# EAGLE schematic Robot2 (EAGLE 9.6.2)
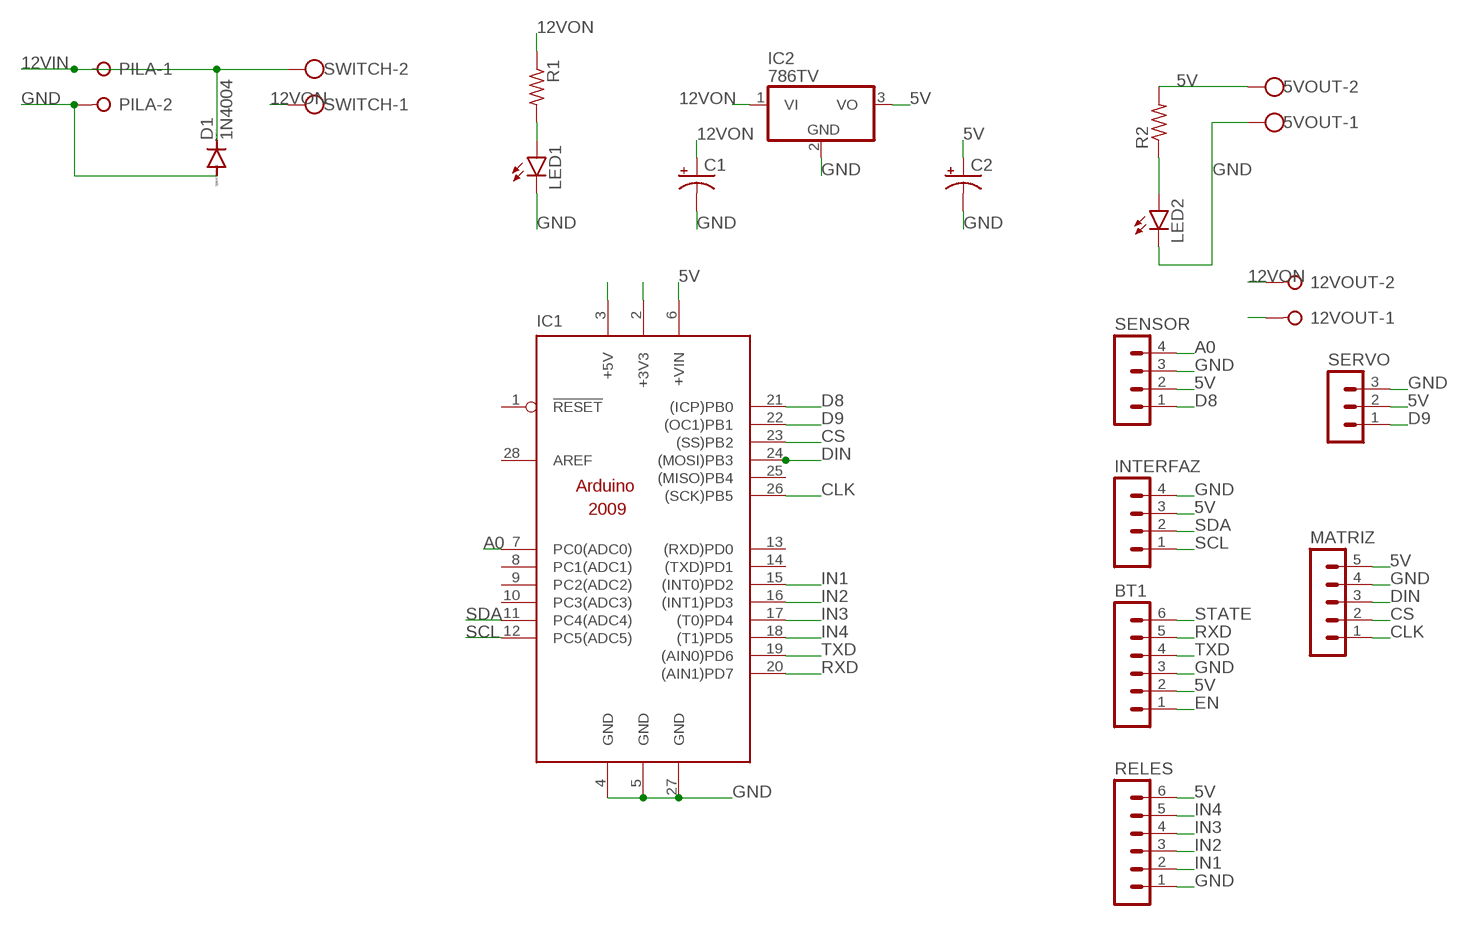
[diagram p0: schematic, sheet 1]

## Parts
5VOUT  W237-102  [W237-102]
12VOUT  W237-02P  [W237-132]
BT1  MA06-1  [MA06-1]
C1  CPOL-USE2,5-6E  [E2,5-6E]
C2  CPOL-USE2,5-6E  [E2,5-6E]
D1  1N4004  [DO41-10]
IC1  ARDUINO2009_PIN_11  [ARDUINO2009_1]
IC2  786TV  [TO220V]
INTERFAZ  MA04-1  [MA04-1]
LED1  LED3MM  [LED3MM]
LED2  LED3MM  [LED3MM]
MATRIZ  MA05-1  [MA05-1]
PILA  W237-02P  [W237-132]
R1  R-US_0204/7  [0204/7]
R2  R-US_0204/7  [0204/7]
RELES  MA06-1  [MA06-1]
SENSOR  MA04-1  [MA04-1]
SERVO  MA03-1  [MA03-1]
SWITCH  W237-102  [W237-102]

## Nets
5V: 5VOUT.2 BT1.2 C2.+ IC1.6(+VIN) IC2.3(VO) INTERFAZ.3 MATRIZ.5 R2.2 RELES.6 SENSOR.2 SERVO.2
12VIN: D1.C PILA.1 SWITCH.2
12VON: 12VOUT.2 C1.+ IC2.1(VI) R1.1 SWITCH.1
A0: IC1.7(PC0(ADC0)) SENSOR.4
CLK: IC1.26((SCK)PB5) MATRIZ.1
CS: IC1.23((SS)PB2) MATRIZ.2
D8: IC1.21((ICP)PB0) SENSOR.1
D9: IC1.22((OC1)PB1) SERVO.1
DIN: IC1.24((MOSI)PB3) MATRIZ.3
EN: BT1.1
GND: 5VOUT.1 12VOUT.1 BT1.3 C1.- C2.- D1.A IC1.4(GND) IC1.5(GND) IC1.27(GND) IC2.2(GND) INTERFAZ.4 LED1.K(C) LED2.K(C) MATRIZ.4 PILA.2 RELES.1 SENSOR.3 SERVO.3
IN1: IC1.15((INT0)PD2) RELES.2
IN2: IC1.16((INT1)PD3) RELES.3
IN3: IC1.17((T0)PD4) RELES.4
IN4: IC1.18((T1)PD5) RELES.5
N$1: LED1.A R1.2
N$10: LED2.A R2.1
N$12: IC1.3(+5V)
N$13: IC1.2(+3V3)
RXD: BT1.5 IC1.20((AIN1)PD7)
SCL: IC1.12(PC5(ADC5)) INTERFAZ.1
SDA: IC1.11(PC4(ADC4)) INTERFAZ.2
STATE: BT1.6
TXD: BT1.4 IC1.19((AIN0)PD6)
Unconnected: IC1.1(!RESET) IC1.8(PC1(ADC1)) IC1.9(PC2(ADC2)) IC1.10(PC3(ADC3)) IC1.13((RXD)PD0) IC1.14((TXD)PD1) IC1.25((MISO)PB4) IC1.28(AREF)

## Library data of the parts
5VOUT SWITCH = con-wago-500:W237-102: WAGO SCREW CLAMP; MPN: 237-102; OC_FARNELL: unknown; OC_NEWARK: 70K9898
12VOUT PILA = con-wago-508:W237-02P: WAGO SREW CLAMP; OC_FARNELL: unknown; OC_NEWARK: unknown
BT1 RELES = con-lstb:MA06-1: PIN HEADER; OC_FARNELL: unknown; OC_NEWARK: unknown
C1 C2 = rcl:CPOL-US: POLARIZED CAPACITOR, American symbol; SPICEPREFIX: C
D1 = diode:1N4004: DIODE general purpose rectifier, 1 A
IC1 = arduino:ARDUINO2009_PIN_1: The Arduino Duemilanove ("2009") is a microcontroller board based on the ATmega168 or ATmega328. - 14 digital input/output pins (of which 6 can be used as PWM outputs) - 6 analog inputs, a 16 MHz crystal oscillator - USB connection - power jack - ISP header - reset button It contains everything needed to support the microcontroller; simply connect it to a computer with a USB cable or power it with a AC-to-DC adapter or battery to get started http://arduino.cc/en/Main/ArduinoBoardDuemilanove
IC2 = linear:78*: Positive VOLTAGE REGULATOR Source: http://cache.national.com/ds/LM/LM78L05.pdf http://www.fairchildsemi.com/ds/LM/LM7805.pdf
INTERFAZ SENSOR = con-lstb:MA04-1: PIN HEADER; OC_FARNELL: unknown; OC_NEWARK: unknown
LED1 LED2 = led:LED: LED OSRAM: - CHIPLED LG R971, LG N971, LY N971, LG Q971, LY Q971, LO R971, LY R971 LH N974, LH R974 LS Q976, LO Q976, LY Q976 LO Q996 - Hyper CHIPLED LW Q18S LB Q993, LB Q99A, LB R99A - SideLED LS A670, LO A670, LY A670, LG A670, LP A670 LB A673, LV A673, LT A673, LW A673 LH A674 LY A675 LS A676, LA A676, LO A676, LY A676, LW A676 LS A679, LY A679, LG A679 - Hyper Micro SIDELED® LS Y876, LA Y876, LO Y876, LY Y876 LT Y87S - SmartLED LW L88C, LW L88S LB L89C, LB L89S, LG L890 LS L89K, LO L89K, LY L89K LS L896, LA L896, LO L896, LY L896 - TOPLED LS T670, LO T670, LY T670, LG T670, LP T670 LSG T670, LSP T670, LSY T670, LOP T670, LYG T670 LG T671, LOG T671, LSG T671 LB T673, LV T673, LT T673, LW T673 LH T674 LS T676, LA T676, LO T676, LY T676, LB T676, LH T676, LSB T676, LW T676 LB T67C, LV T67C, LT T67C, LS T67K, LO T67K, LY T67K, LW E67C LS E67B, LA E67B, LO E67B, LY E67B, LB E67C, LV E67C, LT E67C LW T67C LS T679, LY T679, LG T679 LS T770, LO T770, LY T770, LG T770, LP T770 LB T773, LV T773, LT T773, LW T773 LH T774 LS E675, LA E675, LY E675, LS T675 LS T776, LA T776, LO T776, LY T776, LB T776 LHGB T686 LT T68C, LB T68C - Hyper Mini TOPLED® LB M676 - Mini TOPLED Santana® LG M470 LS M47K, LO M47K, LY M47K Source: http://www.osram.convergy.de LUXEON: - LUMILED® LXK2-PW12-R00, LXK2-PW12-S00, LXK2-PW14-U00, LXK2-PW14-V00 LXK2-PM12-R00, LXK2-PM12-S00, LXK2-PM14-U00 LXK2-PE12-Q00, LXK2-PE12-R00, LXK2-PE12-S00, LXK2-PE14-T00, LXK2-PE14-U00 LXK2-PB12-K00, LXK2-PB12-L00, LXK2-PB12-M00, LXK2-PB14-N00, LXK2-PB14-P00, LXK2-PB14-Q00 LXK2-PR12-L00, LXK2-PR12-M00, LXK2-PR14-Q00, LXK2-PR14-R00 LXK2-PD12-Q00, LXK2-PD12-R00, LXK2-PD12-S00 LXK2-PH12-R00, LXK2-PH12-S00 LXK2-PL12-P00, LXK2-PL12-Q00, LXK2-PL12-R00 Source: www.luxeon.com KINGBRIGHT: KA-3528ASYC Source: www.kingbright.com
MATRIZ = con-lstb:MA05-1: PIN HEADER; OC_FARNELL: unknown; OC_NEWARK: unknown
R1 R2 = rcl:R-US_: RESISTOR, American symbol; SPICEPREFIX: R
SERVO = con-lstb:MA03-1: PIN HEADER; OC_FARNELL: unknown; OC_NEWARK: unknown